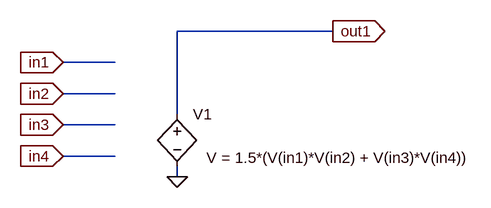
[diagram p0: schematic Power.asc]
Power.asc, the LTspice schematic file:
Version 4
SHEET 1 1740 680
WIRE 656 0 416 0
WIRE 320 48 240 48
WIRE 320 96 240 96
WIRE 416 128 416 0
WIRE 320 144 240 144
WIRE 320 192 240 192
WIRE 416 224 416 208
FLAG 240 48 in1
IOPIN 240 48 In
FLAG 240 96 in2
IOPIN 240 96 In
FLAG 240 144 in3
IOPIN 240 144 In
FLAG 240 192 in4
IOPIN 240 192 In
FLAG 416 224 0
FLAG 656 0 out1
IOPIN 656 0 Out
SYMBOL bv 416 112 R0
WINDOW 3 45 83 Left 2
SYMATTR Value V = 1.5*(V(in1)*V(in2) + V(in3)*V(in4))
SYMATTR InstName V1

The netlist it stands for:
* Power.asc
B§V1 out1 0 V = 1.5*(V(in1)*V(in2) + V(in3)*V(in4))
.backanno
.end